# Altium schematic sheet ACE.SchDoc: uSDR schematic
size Letter; Author: Ye-sheng Kuo; CompanyName: Univ. of Michigan; Revision: 2.0; SheetNumber: 14; SheetTotal: 16
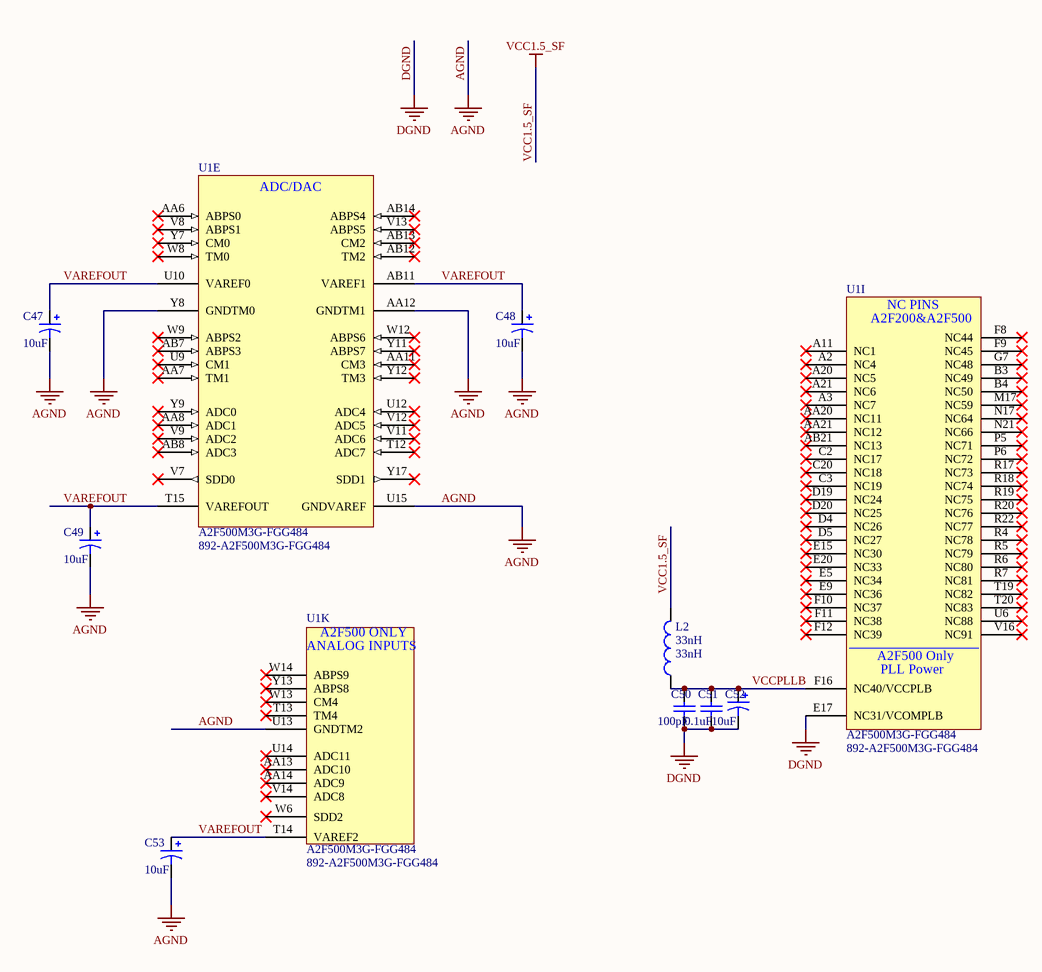
[diagram p0: ACE.SchDoc]

## Parts
C47  10uF  [C0805]
C48  10uF  [C0805]
C49  10uF  [C0805]
C50  100pF  [0402]
C51  0.1uF  [0402]
C52  10uF  [C0805]
C53  10uF  [C0805]
L2  33nH  [0402]
U1  A2F500M3G-FGG484  Supplier Part Number 1: 892-A2F500M3G-FGG484  [BGA100P22X22-484N]  (parts E,I,K of 13)

## Nets
AGND: C47.2 C48.2 C49.2 C53.2 U1.AA12(GNDTM1) U1.U13(GNDTM2) U1.U15(GNDVAREF) U1.Y8(GNDTM0)
DGND: C50.1 C51.1 C52.2 U1.E17(NC31/VCOMPLB)
VCC1.5_SF: L2.2
VAREFOUT: C47.1 C48.1 C49.1 C53.1 U1.AB11(VAREF1) U1.T14(VAREF2) U1.T15(VAREFOUT) U1.U10(VAREF0)
VCCPLLB: C50.2 C51.2 C52.1 L2.1 U1.F16(NC40/VCCPLB)

Not connected (* = marked no-connect by the designer): U1 A2(NC4)* A3(NC7)* A11(NC1)* A20(NC5)* A21(NC6)* AA6(ABPS0)* AA7(TM1)* AA8(ADC1)* AA11(CM3)* AA13(ADC10)* AA14(ADC9)* AA20(NC11)* AA21(NC12)* AB7(ABPS3)* AB8(ADC3)* AB12(TM2)* AB13(CM2)* AB14(ABPS4)* AB21(NC13)* B3(NC49)* B4(NC50)* C2(NC17)* C3(NC19)* C20(NC18)* D4(NC26)* D5(NC27)* D19(NC24)* D20(NC25)* E5(NC34)* E9(NC36)* E15(NC30)* E20(NC33)* F8(NC44)* F9(NC45)* F10(NC37)* F11(NC38)* F12(NC39)* G7(NC48)* M17(NC59)* N17(NC64)* N21(NC66)* P5(NC71)* P6(NC72)* R4(NC78)* R5(NC79)* R6(NC80)* R7(NC81)* R17(NC73)* R18(NC74)* R19(NC75)* R20(NC76)* R22(NC77)* T12(ADC7)* T13(TM4)* T19(NC82)* T20(NC83)* U6(NC88)* U9(CM1)* U12(ADC4)* U14(ADC11)* V7(SDD0)* V8(ABPS1)* V9(ADC2)* V11(ADC6)* V12(ADC5)* V13(ABPS5)* V14(ADC8)* V16(NC91)* W6(SDD2)* W8(TM0)* W9(ABPS2)* W12(ABPS6)* W13(CM4)* W14(ABPS9)* Y7(CM0)* Y9(ADC0)* Y11(ABPS7)* Y12(TM3)* Y13(ABPS8)* Y17(SDD1)*

## Notes on the sheet
- Title
- Date:
- Author:
- Revision:
- Sheet
- of
- University of Michigan
- File:
- (in symbol F2-200_500-FGG484_1, part E) ADC/DAC
- (in symbol F2-200_500-FGG484_1, part I) NC PINS; A2F200&A2F500; A2F500 Only; PLL Power
- (in symbol F2-200_500-FGG484_1, part K) A2F500 ONLY; ANALOG INPUTS

## Library data of the parts
C47-C49 C52 C53 = Cap Pol3: Polarized Capacitor (Surface Mount); Published: 8-Jun-2000; LatestRevisionDate: 29-May-2009; LatestRevisionNote: IPC-7351 Footprint Added.; PackageReference: C0805; Publisher: Altium Limited; PackageDescription: Chip Capacitor; Value: 10uF
C50 C51 = Cap Semi: Capacitor (Semiconductor SIM Model); Published: 8-Jun-2000; LatestRevisionDate: 29-May-2009; LatestRevisionNote: IPC-7351 Footprint Added.; PackageReference: C1206; Publisher: Altium Limited; PackageDescription: Chip Capacitor
  C50: Value: 100pF
  C51: Value: 0.1uF
L2 = Inductor: Code_IEC: 1005; Published: 8-Jun-2000; LatestRevisionDate: 29-May-2009; LatestRevisionNote: IPC-7351 Footprint Added.; PackageReference: 0402-A; Publisher: Altium Limited; PackageDescription: Chip Inductor; Code_JEITA: 0402; Value: 33nH
U1 = F2-200_500-FGG484_1: FPGA - Field Programmable Gate Array 500K System Gates; PPS#: P0934R; Supplier 1: Mouser